# EAGLE schematic zikzak-z80-2 (EAGLE 6.4)
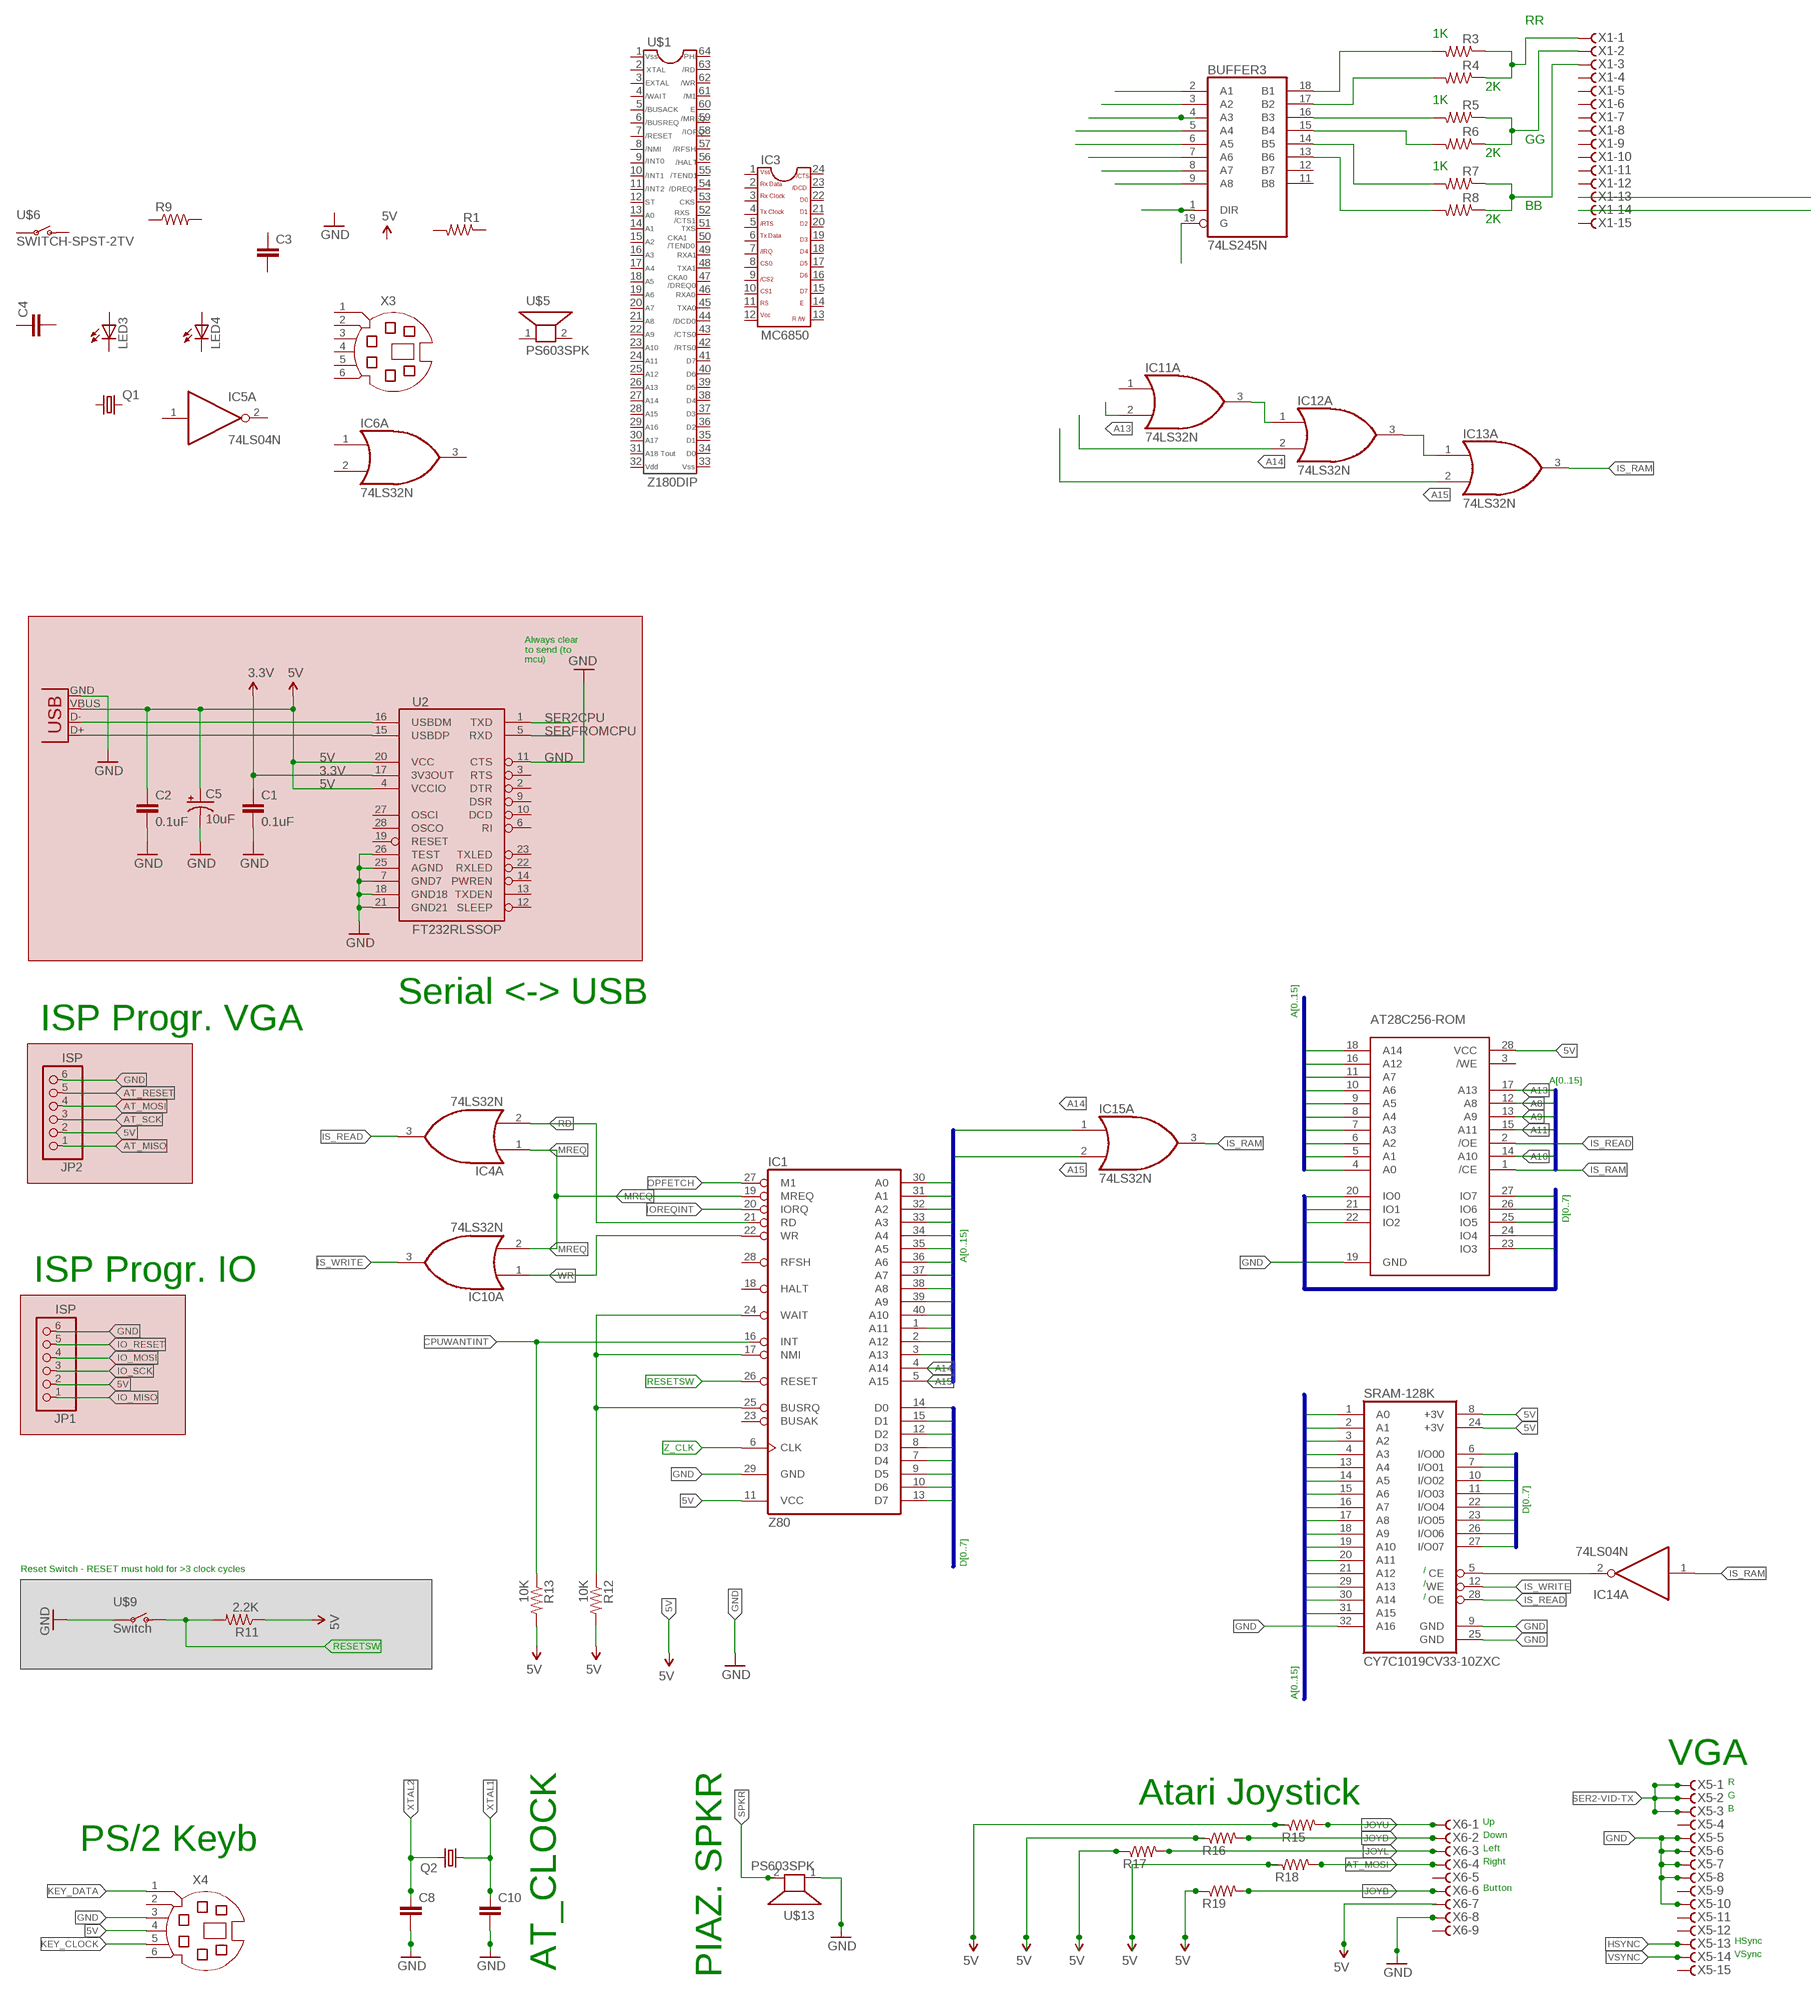
[diagram p0: schematic, sheet 1, part 1 of 2]
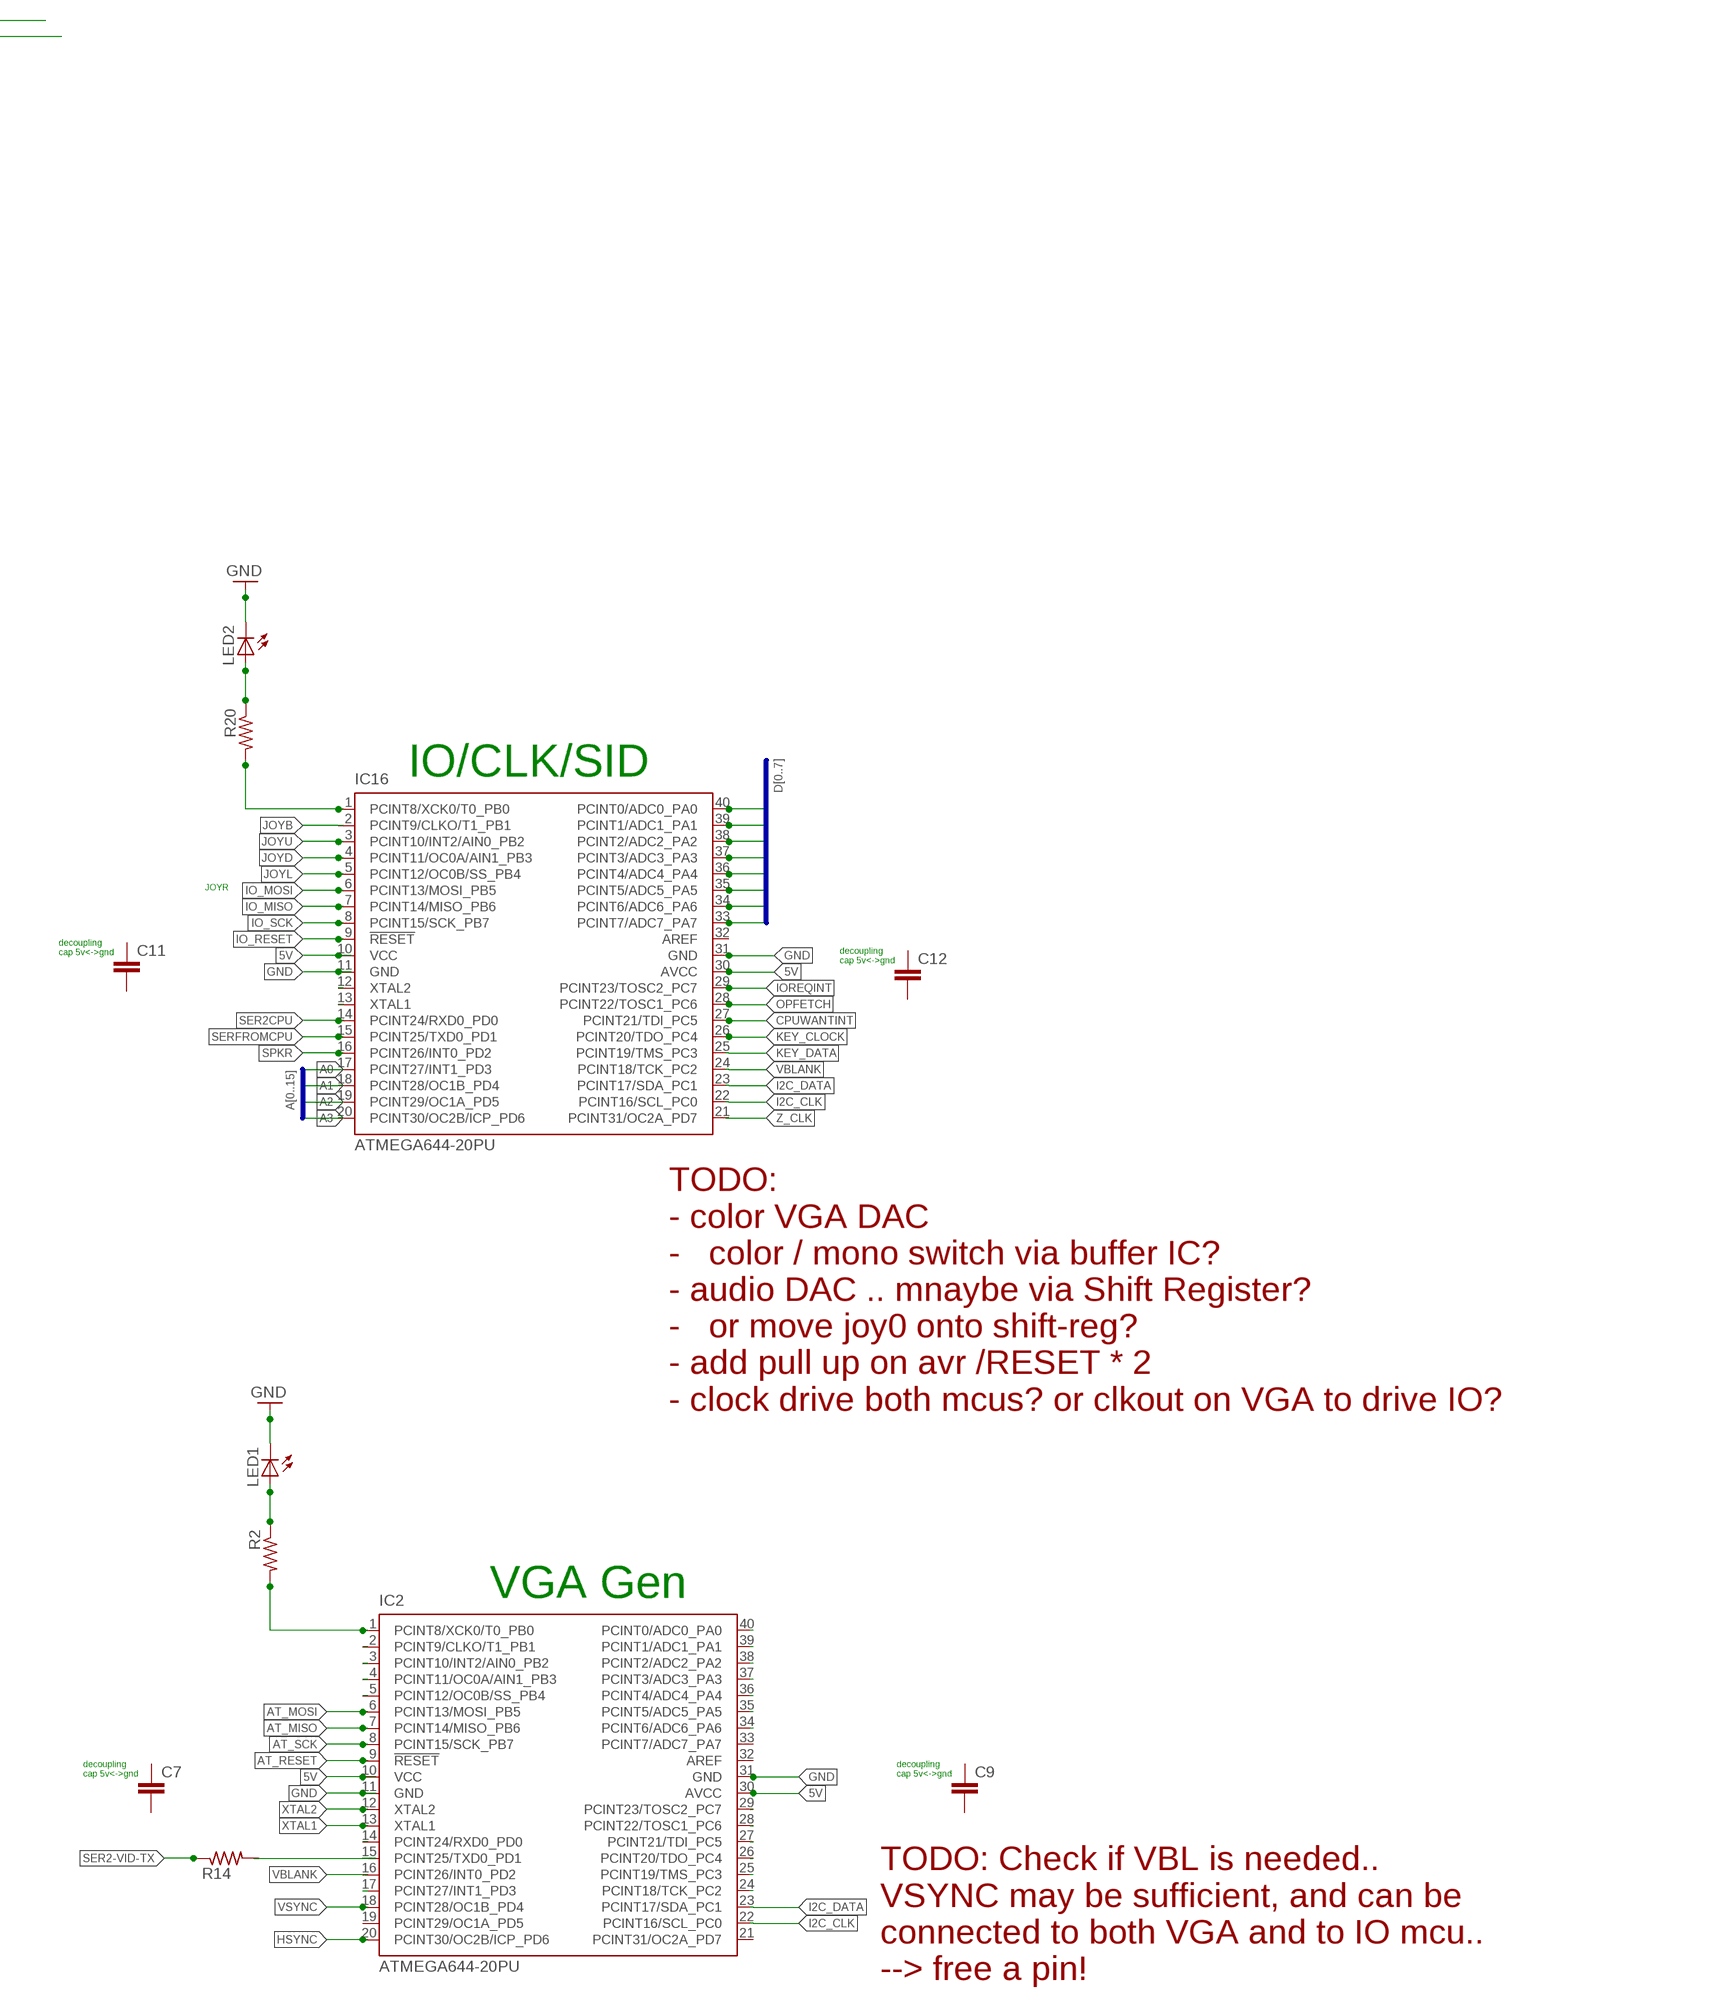
[diagram p1: schematic, sheet 1, part 2 of 2]

## Parts
AT28C256-ROM  AT28C256  [DIL28-4]
BUFFER3  74LS245N  [DIL20]
C1  0.1uF  CAP0402-CAP  [0402-CAP]
C2  0.1uF  CAP0402-CAP  [0402-CAP]
C3  C-EU025-050X050  [C025-050X050]
C4  C-EUC0504  [C0504]
C5  10uF  CAP_POL1206  [EIA3216]
C7  C-EU025-050X050  [C025-050X050]
C8  C-EU025-050X050  [C025-050X050]
C9  C-EU025-050X050  [C025-050X050]
C10  C-EU025-050X050  [C025-050X050]
C11  C-EU025-050X050  [C025-050X050]
C12  C-EU025-050X050  [C025-050X050]
IC1  Z80  Z80CPU  [DIL40]
IC2  ATMEGA644-20PU  [DIL40]
IC3  MC6850  MC6850-ACIA-6  [DIL24-6]
IC4  74LS32N  [DIL14]
IC5  74LS04N  [DIL14]
IC6  74LS32N  [DIL14]
IC10  74LS32N  [DIL14]
IC11  74LS32N  [DIL14]
IC12  74LS32N  [DIL14]
IC13  74LS32N  [DIL14]
IC14  74LS04N  [DIL14]
IC15  74LS32N  [DIL14]
IC16  ATMEGA644-20PU  [DIL40]
JP1  ISP  PINHD-1X6  [1X06]
JP2  ISP  PINHD-1X6  [1X06]
LED1  LEDMINI-TOP  [OSRAM-MINI-TOP-LED]
LED2  LEDMINI-TOP  [OSRAM-MINI-TOP-LED]
LED3  LEDMINI-TOP  [OSRAM-MINI-TOP-LED]
LED4  LEDMINI-TOP  [OSRAM-MINI-TOP-LED]
Q1  CRYSTALHC49S  [HC49/S]
Q2  CRYSTALHC49S  [HC49/S]
R1  R-US_0204/2V  [0204V]
R2  R-US_0204/2V  [0204V]
R3  R-US_0204/2V  [0204V]
R4  R-US_0204/2V  [0204V]
R5  R-US_0204/2V  [0204V]
R6  R-US_0204/2V  [0204V]
R7  R-US_0204/2V  [0204V]
R8  R-US_0204/2V  [0204V]
R9  R-US_0204/7  [0204/7]
R11  2.2K  R-US_0204/7  [0204/7]
R12  10K  R-US_0204/7  [0204/7]
R13  10K  R-US_0204/7  [0204/7]
R14  R-US_0204/2V  [0204V]
R15  R-US_0204/2V  [0204V]
R16  R-US_0204/2V  [0204V]
R17  R-US_0204/2V  [0204V]
R18  R-US_0204/2V  [0204V]
R19  R-US_0204/2V  [0204V]
R20  R-US_0204/2V  [0204V]
SRAM-128K  CY7C1019CV33-10ZXC  [TSOPII-32]
U2  FT232RLSSOP  [SSOP28DB]
U$1  Z180DIP  [DIL64]
U$5  PS603SPK  [PS603]
U$6  SWITCH-SPST-2TV  [SWITCH-SPST-VERTICAL]
U$9  Switch  SWITCH-SPST-2TV  [SWITCH-SPST-VERTICAL]
U$13  PS603SPK  [PS603]
X1  F15HDVS  [HDF15V]
X2  USB-SMD-NS  [USB-MINIB-NOSTOP]
X3  MD06S  [MDIN06S]
X4  MD06S  [MDIN06S]
X5  F15HDVS  [HDF15V]
X6  F15HDVS  [HDF15V]

## Nets
3.3V [power]: C1.1 U2.17(3V3OUT)
5V: AT28C256-ROM.28(VCC) C2.1 C5.A(+) IC1.11(VCC) IC2.10(VCC) IC2.30(AVCC) IC16.10(VCC) IC16.30(AVCC) JP1.2 JP2.2 R11.1 R12.2 R13.2 R15.1 R16.1 R17.1 R18.1 R19.1 SRAM-128K.8(+3V) SRAM-128K.24(+3V) U2.4(VCCIO) U2.20(VCC) X2.VBUS X4.4
+5V: BUFFER3.1(DIR)
A0: AT28C256-ROM.4(A0) IC1.30(A0) IC16.17(PCINT27/INT1_PD3) SRAM-128K.1(A0)
A1: AT28C256-ROM.5(A1) IC1.31(A1) IC16.18(PCINT28/OC1B_PD4) SRAM-128K.2(A1)
A2: AT28C256-ROM.6(A2) IC1.32(A2) SRAM-128K.3(A2)
A3: AT28C256-ROM.7(A3) IC1.33(A3) IC2.25(PCINT19/TMS_PC3) IC16.20(PCINT30/OC2B/ICP_PD6) SRAM-128K.4(A3)
A4: AT28C256-ROM.8(A4) IC1.34(A4) SRAM-128K.13(A4)
A5: AT28C256-ROM.9(A5) IC1.35(A5) SRAM-128K.14(A5)
A6: AT28C256-ROM.10(A6) IC1.36(A6) SRAM-128K.15(A6)
A7: AT28C256-ROM.11(A7) IC1.37(A7) SRAM-128K.16(A7)
A8: AT28C256-ROM.12(A8) IC1.38(A8) SRAM-128K.17(A8)
A9: AT28C256-ROM.13(A9) IC1.39(A9) SRAM-128K.18(A9)
A10: AT28C256-ROM.14(A10) IC1.40(A10) SRAM-128K.19(A10)
A11: AT28C256-ROM.15(A11) IC1.1(A11) SRAM-128K.20(A11)
A12: AT28C256-ROM.16(A12) SRAM-128K.21(A12)
A13: AT28C256-ROM.17(A13) IC11.2(A:I1) SRAM-128K.29(A13)
A14: AT28C256-ROM.18(A14) IC1.4(A14) IC12.2(A:I1) IC15.1(A:I0) SRAM-128K.30(A14)
A15: IC1.5(A15) IC13.2(A:I1) SRAM-128K.31(A15)
AT_MISO: IC2.7(PCINT14/MISO_PB6) JP2.1
AT_MOSI: IC2.6(PCINT13/MOSI_PB5) JP2.4 R18.2 X6.4
AT_RESET: IC2.9(!RESET) JP2.5
AT_SCK: IC2.8(PCINT15/SCK_PB7) JP2.3
CPUWANTINT: IC2.2(PCINT9/CLKO/T1_PB1) IC16.27(PCINT21/TDI_PC5) R13.1
D0: AT28C256-ROM.20(IO0) IC1.14(D0) IC2.40(PCINT0/ADC0_PA0) SRAM-128K.6(I/O00)
D1: AT28C256-ROM.21(IO1) IC1.15(D1) IC2.39(PCINT1/ADC1_PA1) SRAM-128K.7(I/O01)
D2: AT28C256-ROM.22(IO2) IC1.12(D2) IC2.38(PCINT2/ADC2_PA2) SRAM-128K.10(I/O02)
D3: AT28C256-ROM.23(IO3) IC1.8(D3) IC2.37(PCINT3/ADC3_PA3) SRAM-128K.11(I/O03)
D4: AT28C256-ROM.24(IO4) IC1.7(D4) IC2.36(PCINT4/ADC4_PA4) SRAM-128K.22(I/O04)
D5: AT28C256-ROM.25(IO5) IC1.9(D5) IC2.35(PCINT5/ADC5_PA5) SRAM-128K.23(I/O05)
D6: AT28C256-ROM.26(IO6) IC1.10(D6) IC2.34(PCINT6/ADC6_PA6) SRAM-128K.26(I/O06)
D7: AT28C256-ROM.27(IO7) IC1.13(D7) SRAM-128K.27(I/O07)
D8: IC16.40(PCINT0/ADC0_PA0)
D9: IC16.39(PCINT1/ADC1_PA1)
D10: IC16.38(PCINT2/ADC2_PA2)
D11: IC16.37(PCINT3/ADC3_PA3)
D12: IC16.36(PCINT4/ADC4_PA4)
D13: IC16.35(PCINT5/ADC5_PA5)
D14: IC16.34(PCINT6/ADC6_PA6)
D15: IC16.33(PCINT7/ADC7_PA7)
GND [power]: AT28C256-ROM.19(GND) C1.2 C2.2 C5.C(-) C8.2 C10.2 IC1.29(GND) IC2.11(GND) IC2.31(GND) IC16.11(GND) IC16.31(GND) JP1.6 JP2.6 LED1.C LED2.C SRAM-128K.9(GND) SRAM-128K.25(GND) SRAM-128K.32(A16) U2.7(GND7) U2.11(CTS) U2.18(GND18) U2.21(GND21) U2.25(AGND) U2.26(TEST) U$9.2(P) U$13.1 X2.GND X4.3 X5.5 X5.6 X5.7 X5.8 X5.10 X6.8
HSYNC: IC2.20(PCINT30/OC2B/ICP_PD6) X5.13
I2C_CLK: IC2.22(PCINT16/SCL_PC0) IC16.22(PCINT16/SCL_PC0)
I2C_DATA: IC2.23(PCINT17/SDA_PC1) IC16.23(PCINT17/SDA_PC1)
IO_MISO: IC16.7(PCINT14/MISO_PB6) JP1.1
IO_MOSI: IC16.6(PCINT13/MOSI_PB5) JP1.4
IO_RESET: IC16.9(!RESET) JP1.5
IO_SCK: IC16.8(PCINT15/SCK_PB7) JP1.3
IOREQINT: IC1.20(IORQ) IC2.29(PCINT23/TOSC2_PC7) IC16.29(PCINT23/TOSC2_PC7)
IS_RAM: AT28C256-ROM.1(/CE) IC13.3(A:O) IC14.1(A:I) IC15.3(A:O)
IS_READ: AT28C256-ROM.2(/OE) IC4.3(A:O) SRAM-128K.28(OE)
IS_WRITE: IC10.3(A:O) SRAM-128K.12(WE)
JOYB: IC16.1(PCINT8/XCK0/T0_PB0) IC16.2(PCINT9/CLKO/T1_PB1) R19.2 R20.2 X6.6
JOYD: IC2.4(PCINT11/OC0A/AIN1_PB3) IC16.4(PCINT11/OC0A/AIN1_PB3) R16.2 X6.2
JOYL: IC2.5(PCINT12/OC0B/SS_PB4) IC16.5(PCINT12/OC0B/SS_PB4) R17.2 X6.3
JOYU: IC2.3(PCINT10/INT2/AIN0_PB2) IC16.3(PCINT10/INT2/AIN0_PB2) R15.2 X6.1
KEY_CLOCK: IC2.28(PCINT22/TOSC1_PC6) IC16.26(PCINT20/TDO_PC4) X4.5
KEY_DATA: IC2.27(PCINT21/TDI_PC5) IC16.25(PCINT19/TMS_PC3) X4.1
MREQ: IC1.19(MREQ) IC4.1(A:I0) IC10.2(A:I1)
N$1: IC11.3(A:O) IC12.1(A:I0)
N$2: IC12.3(A:O) IC13.1(A:I0)
N$3: R14.2
N$4: IC1.17(NMI) IC1.24(WAIT) IC1.25(BUSRQ) R12.1
N$7: IC14.2(A:O) SRAM-128K.5(CE)
N$8: IC2.1(PCINT8/XCK0/T0_PB0) R2.2
N$9: LED1.A R2.1
N$10: IC2.17(PCINT27/INT1_PD3)
N$11: BUFFER3.5(A4)
N$12: BUFFER3.4(A3)
N$14: LED2.A R20.1
N$105: BUFFER3.3(A2)
N$106: BUFFER3.2(A1)
N$109: BUFFER3.6(A5)
N$110: BUFFER3.7(A6)
N$111: BUFFER3.8(A7)
N$112: BUFFER3.9(A8)
N$113: BUFFER3.18(B1) R3.2
N$114: BUFFER3.17(B2) R4.2
N$115: BUFFER3.16(B3) R5.2
N$116: BUFFER3.15(B4) R6.2
N$117: BUFFER3.14(B5) R7.2
N$118: BUFFER3.13(B6) R8.2
N$119: R3.1 R4.1 X1.1
N$121: R5.1 R6.1 X1.2
N$122: X1.13
N$123: R7.1 R8.1 X1.3
N$124: X1.14
N$125: BUFFER3.19(G)
OPFETCH: IC1.27(M1) IC2.26(PCINT20/TDO_PC4) IC16.28(PCINT22/TOSC1_PC6)
RD: IC1.21(RD) IC4.2(A:I1)
RESETSW: IC1.26(RESET) R11.2 U$9.1(O)
SER2-VID-TX: R14.1 X5.1 X5.2 X5.3
SER2CPU: IC2.14(PCINT24/RXD0_PD0) IC16.14(PCINT24/RXD0_PD0) U2.1(TXD)
SERFROMCPU: IC16.15(PCINT25/TXD0_PD1) U2.5(RXD)
SPKR: IC16.16(PCINT26/INT0_PD2) U$13.2
USB_D+: U2.15(USBDP) X2.D+
USB_D-: U2.16(USBDM) X2.D-
VBLANK: IC2.15(PCINT25/TXD0_PD1) IC2.16(PCINT26/INT0_PD2) IC2.24(PCINT18/TCK_PC2) IC16.24(PCINT18/TCK_PC2)
VSYNC: IC2.18(PCINT28/OC1B_PD4) X5.14
WR: IC1.22(WR) IC10.1(A:I0)
XTAL1: C10.1 IC2.13(XTAL1) IC16.13(XTAL1) Q2.1
XTAL2: C8.1 IC2.12(XTAL2) IC16.12(XTAL2) Q2.2
Z_CLK: IC1.6(CLK)
Unconnected: AT28C256-ROM.3(/WE) BUFFER3.11(B8) BUFFER3.12(B7) C3.1 C3.2 C4.1 C4.2 C7.1 C7.2 C9.1 C9.2 C11.1 C11.2 C12.1 C12.2 IC1.2(A12) IC1.3(A13) IC1.16(INT) IC1.18(HALT) IC1.23(BUSAK) IC1.28(RFSH) IC2.19(PCINT29/OC1A_PD5) IC2.21(PCINT31/OC2A_PD7) IC2.32(AREF) IC2.33(PCINT7/ADC7_PA7) IC3.1 IC3.2 IC3.3 IC3.4 IC3.5 IC3.6 IC3.7 IC3.8 IC3.9 IC3.10 IC3.11 IC3.12 IC3.13 IC3.14 IC3.15 IC3.16 IC3.17 IC3.18 IC3.19 IC3.20 IC3.21 IC3.22 IC3.23 IC3.24 IC4.4(B:I0) IC4.5(B:I1) IC4.6(B:O) IC4.8(C:O) IC4.9(C:I0) IC4.10(C:I1) IC4.11(D:O) IC4.12(D:I0) IC4.13(D:I1) IC5.1(A:I) IC5.2(A:O) IC5.3(B:I) IC5.4(B:O) IC5.5(C:I) IC5.6(C:O) IC5.8(D:O) IC5.9(D:I) IC5.10(E:O) IC5.11(E:I) IC5.12(F:O) IC5.13(F:I) IC6.1(A:I0) IC6.2(A:I1) IC6.3(A:O) IC6.4(B:I0) IC6.5(B:I1) IC6.6(B:O) IC6.8(C:O) IC6.9(C:I0) IC6.10(C:I1) IC6.11(D:O) IC6.12(D:I0) IC6.13(D:I1) IC10.4(B:I0) IC10.5(B:I1) IC10.6(B:O) IC10.8(C:O) IC10.9(C:I0) IC10.10(C:I1) IC10.11(D:O) IC10.12(D:I0) IC10.13(D:I1) IC11.1(A:I0) IC11.4(B:I0) IC11.5(B:I1) IC11.6(B:O) IC11.8(C:O) IC11.9(C:I0) IC11.10(C:I1) IC11.11(D:O) IC11.12(D:I0) IC11.13(D:I1) IC12.4(B:I0) IC12.5(B:I1) IC12.6(B:O) IC12.8(C:O) IC12.9(C:I0) IC12.10(C:I1) IC12.11(D:O) IC12.12(D:I0) IC12.13(D:I1) IC13.4(B:I0) IC13.5(B:I1) IC13.6(B:O) IC13.8(C:O) IC13.9(C:I0) IC13.10(C:I1) IC13.11(D:O) IC13.12(D:I0) IC13.13(D:I1) IC14.3(B:I) IC14.4(B:O) IC14.5(C:I) IC14.6(C:O) IC14.8(D:O) IC14.9(D:I) IC14.10(E:O) IC14.11(E:I) IC14.12(F:O) IC14.13(F:I) IC15.2(A:I1) IC15.4(B:I0) IC15.5(B:I1) IC15.6(B:O) IC15.8(C:O) IC15.9(C:I0) IC15.10(C:I1) IC15.11(D:O) IC15.12(D:I0) IC15.13(D:I1) IC16.19(PCINT29/OC1A_PD5) IC16.21(PCINT31/OC2A_PD7) IC16.32(AREF) LED3.A LED3.C LED4.A LED4.C Q1.1 Q1.2 R1.1 R1.2 R9.1 R9.2 U2.2(DTR) U2.3(RTS) U2.6(RI) U2.9(DSR) U2.10(DCD) U2.12(SLEEP) U2.13(TXDEN) U2.14(PWREN) U2.19(RESET) U2.22(RXLED) U2.23(TXLED) U2.27(OSCI) U2.28(OSCO) U$1.1(VSS) U$1.2(XTAL) U$1.3 U$1.4 U$1.5 U$1.6 U$1.7 U$1.8 U$1.9 U$1.10 U$1.11 U$1.12 U$1.13 U$1.14 U$1.15 U$1.16 U$1.17 U$1.18 U$1.19 U$1.20 U$1.21 U$1.22 U$1.23 U$1.24 U$1.25 U$1.26 U$1.27 U$1.28 U$1.29 U$1.30 U$1.31 U$1.32 U$1.33 U$1.34 U$1.35 U$1.36 U$1.37 U$1.38 U$1.39 U$1.40 U$1.41 U$1.42 U$1.43 U$1.44 U$1.45 U$1.46 U$1.47 U$1.48 U$1.49 U$1.50 U$1.51 U$1.52 U$1.53 U$1.54 U$1.55 U$1.56 U$1.57 U$1.58 U$1.59 U$1.60 U$1.61 U$1.62 U$1.63 U$1.64(PHI) U$5.1 U$5.2 U$6.1(O) U$6.2(P) X1.4 X1.5 X1.6 X1.7 X1.8 X1.9 X1.10 X1.11 X1.12 X1.15 X3.1 X3.2 X3.3 X3.4 X3.5 X3.6 X4.2 X4.6 X5.4 X5.9 X5.11 X5.12 X5.15 X6.5 X6.7 X6.9 X6.10 X6.11 X6.12 X6.13 X6.14 X6.15

## Buses
A[0..15]
D[0..7]

## Notes on the sheet
- RR
- 1K
- 2K
- 1K
- GG
- 2K
- 1K
- BB
- 2K
- Always clear
  to send (to
  mcu)
- IO/CLK/SID
- JOYR
- decoupling
  cap 5v<->gnd
- decoupling
  cap 5v<->gnd
- Serial <-> USB
- ISP Progr. VGA
- ISP Progr. IO
- TODO:
  - color VGA DAC
  -   color / mono switch via buffer IC?
  - audio DAC .. mnaybe via Shift Register?
  -   or move joy0 onto shift-reg?
  - add pull up on avr /RESET * 2
  - clock drive both mcus? or clkout on VGA to drive IO?
- VGA Gen
- Reset Switch - RESET must hold for >3 clock cycles | /
- /
- /
- decoupling
  cap 5v<->gnd
- decoupling
  cap 5v<->gnd
- VGA
- R
- TODO: Check if VBL is needed.. 
  VSYNC may be sufficient, and can be
  connected to both VGA and to IO mcu..
  --> free a pin!
- G
- Atari Joystick
- B
- Up
- Down
- PS/2 Keyb | Left
- Right
- Button
- HSync
- VSync
- AT_CLOCK | PIAZ. SPKR

## Power pins joined to a net without a drawn wire
GND: BUFFER3.10(GND) IC4.7(P:GND) IC5.7(P:GND) IC6.7(P:GND) IC10.7(P:GND) IC11.7(P:GND) IC12.7(P:GND) IC13.7(P:GND) IC14.7(P:GND) IC15.7(P:GND)
VCC: BUFFER3.20(VCC) IC4.14(P:VCC) IC5.14(P:VCC) IC6.14(P:VCC) IC10.14(P:VCC) IC11.14(P:VCC) IC12.14(P:VCC) IC13.14(P:VCC) IC14.14(P:VCC) IC15.14(P:VCC)

## Library data of the parts
AT28C256-ROM = skeezix:AT28C256
BUFFER3 = 74xx-us:74*245: Octal BUS TRANSCEIVER, 3-state
C1 C2 = SparkFun:CAP: Capacitor Standard 0603 ceramic capacitor, and 0.1" leaded capacitor.
C3 C4 C7-C12 = rcl:C-EU: CAPACITOR, European symbol
C5 = SparkFun:CAP_POL: Capacitor Polarized These are standard SMD and PTH capacitors. Normally 10uF, 47uF, and 100uF in electrolytic and tantalum varieties. Always verify the external diameter of the through hole cap, it varies with capacity, voltage, and manufacturer. The EIA devices should be standard.
IC1 = zilog:Z80CPU: Z80 FAMILY DEVICE
IC2 IC16 = atmel:ATMEGA644-*PU: 8-bit Microcontroller with 64K Bytes In-System Programmable Flash Auto generated by make-symbol-device-package-bsdl.ulp Rev. 34 Source: http://www.atmel.com/dyn/resources/prod_documents/doc2593.pdf; MPN: ATMEGA644-20PU; OC_FARNELL: 1288340; OC_NEWARK: 23M5060
IC3 = skeezix:MC6850-ACIA: Dual In Line
IC4 IC6 IC10-IC13 IC15 = 74xx-us:74*32: Quad 2-input OR gate
IC5 IC14 = 74xx-us:74*04: Hex INVERTER
JP1 JP2 = pinhead:PINHD-1X6: PIN HEADER
LED1-LED4 = led:LED: LED OSRAM: - CHIPLED LG R971, LG N971, LY N971, LG Q971, LY Q971, LO R971, LY R971 LH N974, LH R974 LS Q976, LO Q976, LY Q976 LO Q996 - Hyper CHIPLED LW Q18S LB Q993, LB Q99A, LB R99A - SideLED LS A670, LO A670, LY A670, LG A670, LP A670 LB A673, LV A673, LT A673, LW A673 LH A674 LY A675 LS A676, LA A676, LO A676, LY A676, LW A676 LS A679, LY A679, LG A679 - Hyper Micro SIDELED® LS Y876, LA Y876, LO Y876, LY Y876 LT Y87S - SmartLED LW L88C, LW L88S LB L89C, LB L89S, LG L890 LS L89K, LO L89K, LY L89K LS L896, LA L896, LO L896, LY L896 - TOPLED LS T670, LO T670, LY T670, LG T670, LP T670 LSG T670, LSP T670, LSY T670, LOP T670, LYG T670 LG T671, LOG T671, LSG T671 LB T673, LV T673, LT T673, LW T673 LH T674 LS T676, LA T676, LO T676, LY T676, LB T676, LH T676, LSB T676, LW T676 LB T67C, LV T67C, LT T67C, LS T67K, LO T67K, LY T67K, LW E67C LS E67B, LA E67B, LO E67B, LY E67B, LB E67C, LV E67C, LT E67C LW T67C LS T679, LY T679, LG T679 LS T770, LO T770, LY T770, LG T770, LP T770 LB T773, LV T773, LT T773, LW T773 LH T774 LS E675, LA E675, LY E675, LS T675 LS T776, LA T776, LO T776, LY T776, LB T776 LHGB T686 LT T68C, LB T68C - Hyper Mini TOPLED® LB M676 - Mini TOPLED Santana® LG M470 LS M47K, LO M47K, LY M47K Source: http://www.osram.convergy.de LUXEON: - LUMILED® LXK2-PW12-R00, LXK2-PW12-S00, LXK2-PW14-U00, LXK2-PW14-V00 LXK2-PM12-R00, LXK2-PM12-S00, LXK2-PM14-U00 LXK2-PE12-Q00, LXK2-PE12-R00, LXK2-PE12-S00, LXK2-PE14-T00, LXK2-PE14-U00 LXK2-PB12-K00, LXK2-PB12-L00, LXK2-PB12-M00, LXK2-PB14-N00, LXK2-PB14-P00, LXK2-PB14-Q00 LXK2-PR12-L00, LXK2-PR12-M00, LXK2-PR14-Q00, LXK2-PR14-R00 LXK2-PD12-Q00, LXK2-PD12-R00, LXK2-PD12-S00 LXK2-PH12-R00, LXK2-PH12-S00 LXK2-PL12-P00, LXK2-PL12-Q00, LXK2-PL12-R00 Source: www.luxeon.com KINGBRIGHT: KA-3528ASYC Source: www.kingbright.com
Q1 Q2 = adafruit:CRYSTAL: CRYSTAL; OC_FARNELL: 1667008; OC_NEWARK: unknown
R1-R9 R11-R20 = rcl:R-US_: RESISTOR, American symbol
SRAM-128K = memory-sram:CY7C1019CV33: 128K x 8 Static RAM 10ns Source: Cypress CYP05780611.pdf
U2 = SparkFun:FT232RL: USB UART FT232RL 4th Generation USB UART (USB <-> Serial) Controller. Spark Fun Electronics SKU : COM-00650
U$1 = skeezix:Z180DIP
U$5 U$13 = adafruit:PS603: PS603 Small 8 ohm speaker, from Mouser. Can SMT solder to board http://www.ladyada.net/library/pcb/eaglelibrary.html
U$6 U$9 = SparkFun-Electromechanical:SWITCH-SPST-2
X1 X5 X6 = con-subd:F15?S: SUB-D; OC_FARNELL: unknown; OC_NEWARK: unknown
X2 = SparkFun:USB: USB Connectors USB-B-PTH is fully proven SKU : PRT-00139 USB-miniB is fully proven SKU : PRT-00587 USB-A-PCB is untested. USB-A-H is throughly reviewed, but untested. Spark Fun Electronics SKU : PRT-00437 USB-B-SMT is throughly reviewed, but untested. Needs silkscreen touching up. USB-A-S has not been used/tested USB-MB-H has not been used/tested
X3 X4 = con-yamaichi:MD06S: YAMAICHI CONNECTOR; OC_FARNELL: unknown; OC_NEWARK: unknown

## Net classes
1 power: width 0.254 mm